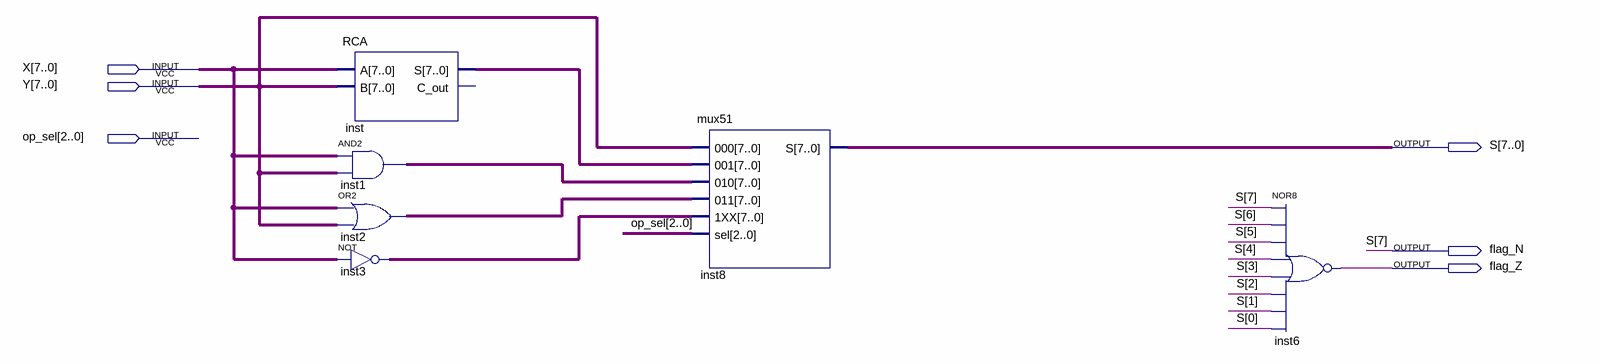
[diagram p0: schematic sheet]
// Quartus schematic ula.bdf as structural Verilog: 6 symbols, 6 pins
module ula (
  input  [7:0] X,
  input  [7:0] Y,
  input  [2:0] op_sel,
  output [7:0] S,
  output flag_N,
  output flag_Z
);

  wire [7:0] inst1_out, inst2_out, inst3_out, inst_s;

  RCA inst (.A(X), .B(Y), .S(inst_s));  // open: C_out
  assign inst1_out = X & Y;  // AND2 inst1, 8 bits wide
  assign inst2_out = X | Y;  // OR2 inst2, 8 bits wide
  assign inst3_out = ~X;  // NOT inst3, 8 bits wide
  mux51 inst8 (
    .\000 (Y), .\001 (inst_s), .\010 (inst1_out), .\011 (inst2_out), .\1XX (inst3_out), .sel(op_sel),
    .S({flag_N, S[6:0]}));
  nor inst6 (flag_Z, flag_N, S[6], S[5], S[4], S[3], S[2], S[1], S[0]);

  assign S[7] = flag_N;
endmodule
